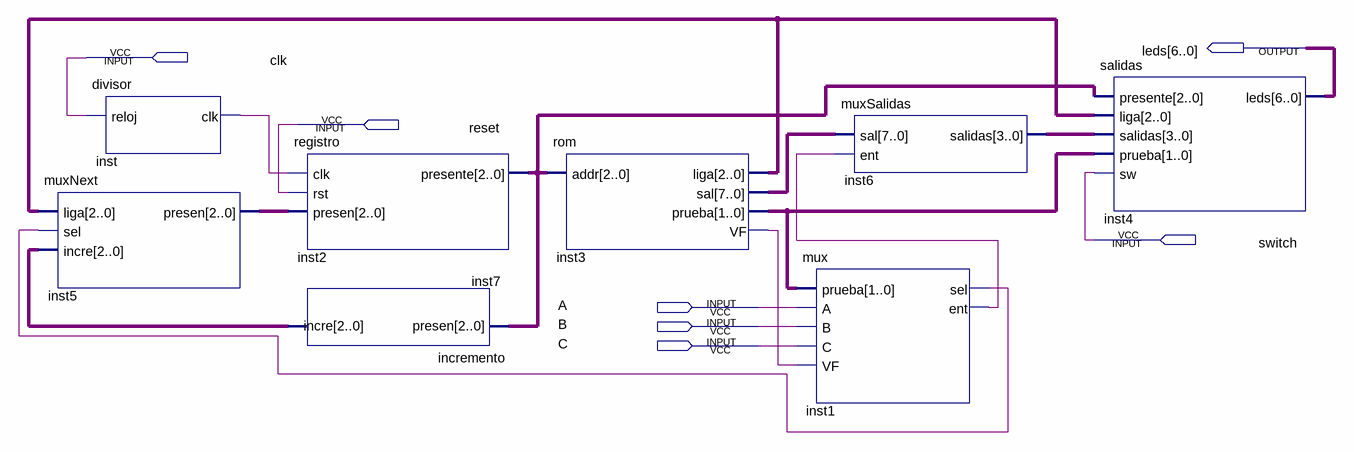
[diagram p0: schematic sheet]
// Quartus schematic prac5.bdf as structural Verilog: 8 symbols, 7 pins
module prac5 (
  input  clk,
  input  reset,
  input  switch,
  input  A,
  input  B,
  input  C,
  output [6:0] leds
);

  wire inst1_ent, inst1_sel, inst3_vf, inst_clk;
  wire [1:0] inst3_prueba;
  wire [2:0] inst2_presente, inst3_liga, inst5_presen, inst7_incre;
  wire [3:0] inst6_salidas;
  wire [7:0] inst3_sal;

  muxNext inst5 (.liga(inst3_liga), .sel(inst1_sel), .incre(inst7_incre), .presen(inst5_presen));
  divisor inst (.reloj(clk), .clk(inst_clk));
  registro inst2 (.clk(inst_clk), .rst(reset), .presen(inst5_presen), .presente(inst2_presente));
  incremento inst7 (.presen(inst2_presente), .incre(inst7_incre));
  rom inst3 (.addr(inst2_presente), .liga(inst3_liga), .sal(inst3_sal), .prueba(inst3_prueba), .VF(inst3_vf));
  mux inst1 (.prueba(inst3_prueba), .A(A), .B(B), .C(C), .VF(inst3_vf), .sel(inst1_sel), .ent(inst1_ent));
  muxSalidas inst6 (.sal(inst3_sal), .ent(inst1_ent), .salidas(inst6_salidas));
  salidas inst4 (
    .presente(inst2_presente), .liga(inst3_liga), .salidas(inst6_salidas), .prueba(inst3_prueba),
    .sw(switch), .leds(leds));
endmodule
